# Altium project led-wt32-eth01.PrjPcb
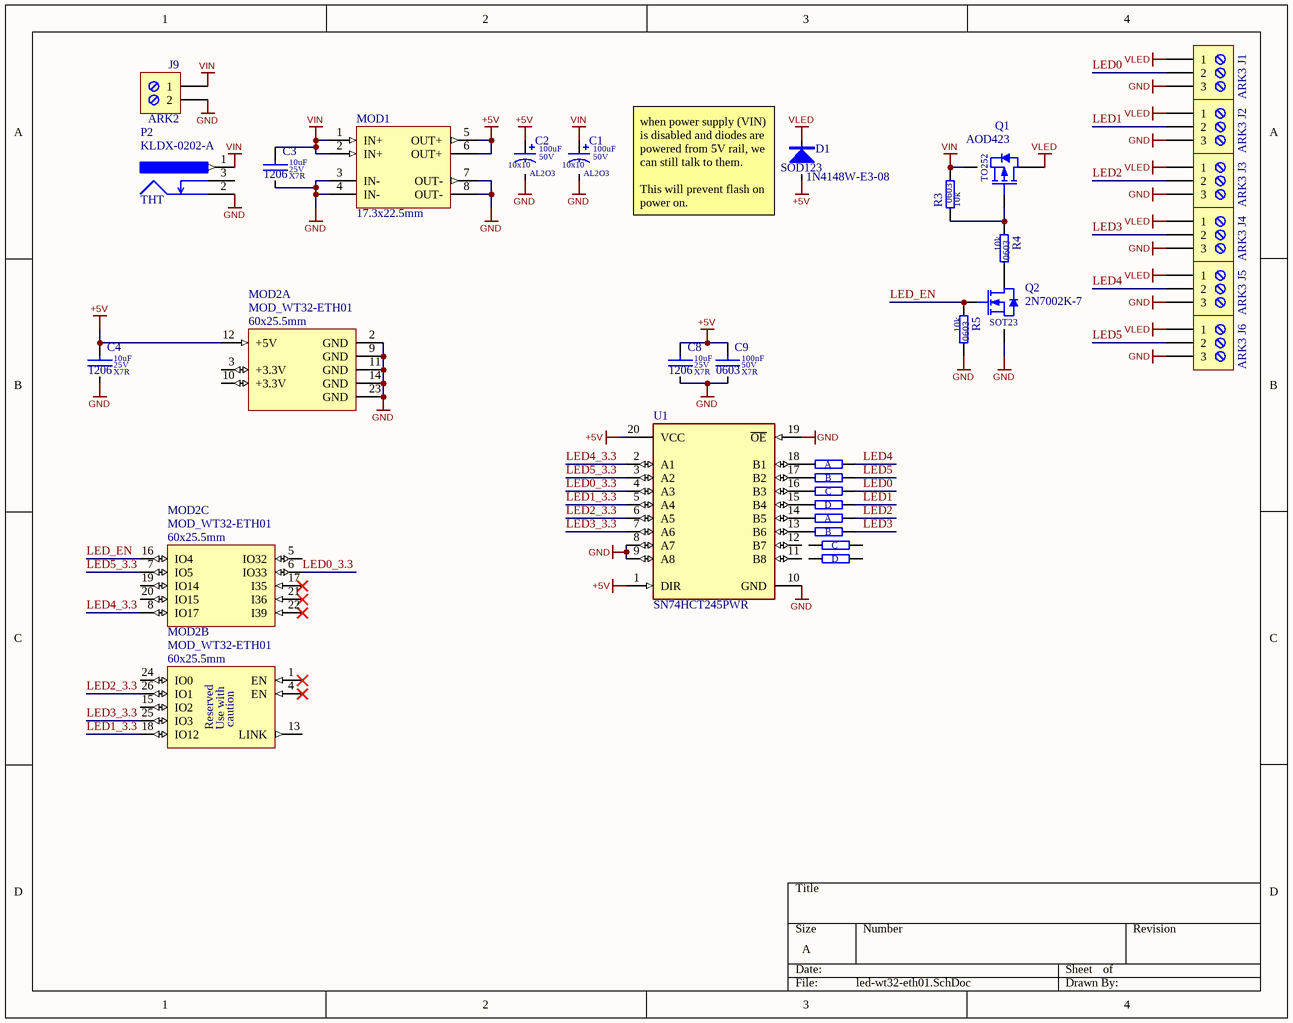
[diagram p0: led-wt32-eth01.SchDoc]
1 sheet, 25 parts. Net scope: global (net labels, ports and power ports of the same name join across sheets).
Board file: led-wt32-eth01.PcbDoc

## Sheet led-wt32-eth01.SchDoc
size A; SheetNumber: 1; SheetTotal: 1

### Parts
C1  value 100uF  Dielectric: AL2O3  SCH_Footprint: 10x10  Voltage: 50V  [CE_D_10x10_SMD]  (hidden comment: Electrolytic Capacitor)
C2  value 100uF  Dielectric: AL2O3  SCH_Footprint: 10x10  Voltage: 50V  [CE_D_10x10_SMD]  (hidden comment: Electrolytic Capacitor)
C3  value 10uF  Dielectric: X7R  Voltage: 25V  SCH_Footprint: 1206  [C_1206_3216]  (hidden comment: Ceramic X7R)
C4  value 10uF  Dielectric: X7R  Voltage: 25V  SCH_Footprint: 1206  [C_1206_3216]  (hidden comment: Ceramic X7R)
C8  value 10uF  Dielectric: X7R  Voltage: 25V  SCH_Footprint: 1206  [C_1206_3216]  (hidden comment: Ceramic X7R)
C9  value 100nF  Dielectric: X7R  Voltage: 50V  SCH_Footprint: 0603  [C_0603_1608]  (hidden comment: Ceramic X7R)
D1  value 1N4148W-E3-08  [SOD123]  (hidden comment: 1N4148W)
J1  ARK3  [J_ARK3]
J2  ARK3  [J_ARK3]
J3  ARK3  [J_ARK3]
J4  ARK3  [J_ARK3]
J5  ARK3  [J_ARK3]
J6  ARK3  [J_ARK3]
J9  ARK2  [J_ARK2]
MOD1  SCH_Footprint: 17.3x22.5mm  [MOD_BUCK_MP1584]  (hidden comment: Low cost, Aliexpress-ready DC-DC buck converter using MP1584)
MOD2  value MOD_WT32-ETH01  SCH_Footprint: 60x25.5mm  [MOD_WT32-ETH01]  (hidden comment: ESP32 with 10/100 Mbps Ethernet PHY)  (parts A,B,C of 3)
P2  value KLDX-0202-A  SCH_Footprint: THT  [P_KLDX-0202-A]  (hidden comment: DC JACK)
Q1  SCH_Footprint: TO252  [DPAK_TO252-3_SC63_M]  (hidden comment: AOD423)
Q2  SCH_Footprint: SOT23  [SOT23_TO236_SC59]  (hidden comment: 2N7002K-7)
R3  value 10k  SCH_Footprint: 0603  [R_0603_1608]  (hidden comment: Resistor)
R4  value 10k  SCH_Footprint: 0603  [R_0603_1608]  (hidden comment: Resistor)
R5  value 10k  SCH_Footprint: 0603  [R_0603_1608]  (hidden comment: Resistor)
RN1  Resistors Network  [RN4_0804_2010]  (value not drawn)  (parts A,B,C,D of 4)
RN2  Resistors Network  [RN4_0804_2010]  (value not drawn)  (parts A,B,C,D of 4)
U1  SN74HCT245PWR  [FP-PW0020A-MFG]

### Nets
+5V: C2.1 C4.1 C8.1 C9.1 D1.2 MOD1.5(OUT+) MOD1.6(OUT+) MOD2.12(+5V) U1.1(DIR) U1.20(VCC)
GND: C1.2 C2.2 C3.2 C4.2 C8.2 C9.2 J1.3 J2.3 J3.3 J4.3 J5.3 J6.3 J9.2 MOD1.3(IN-) MOD1.4(IN-) MOD1.7(OUT-) MOD1.8(OUT-) MOD2.2(GND) MOD2.9(GND) MOD2.11(GND) MOD2.14(GND) MOD2.23(GND) P2.2 Q2.2(S) R5.2 U1.8(A7) U1.9(A8) U1.10(GND) U1.19(~{OE})
VIN: C1.1 C3.1 J9.1 MOD1.1(IN+) MOD1.2(IN+) P2.1 Q1.3(S) R3.2
VLED: D1.1 J1.1 J2.1 J3.1 J4.1 J5.1 J6.1 Q1.2(D)
LED0: J1.2 RN1.6
LED0_3.3: MOD2.6(IO33) U1.4(A3)
LED1: J2.2 RN1.5
LED1_3.3: MOD2.18(IO12) U1.5(A4)
LED2: J3.2 RN2.8
LED2_3.3: MOD2.26(IO1) U1.6(A5)
LED3: J4.2 RN2.7
LED3_3.3: MOD2.25(IO3) U1.7(A6)
LED4: J5.2 RN1.8
LED4_3.3: MOD2.8(IO17) U1.2(A1)
LED5: J6.2 RN1.7
LED5_3.3: MOD2.7(IO5) U1.3(A2)
LED_EN: MOD2.16(IO4) Q2.1(G) R5.1
NetQ1_1: Q1.1(G) R3.1 R4.1
NetQ2_3: Q2.3(D) R4.2
NetRN1_1: RN1.1 U1.18(B1)
NetRN1_2: RN1.2 U1.17(B2)
NetRN1_3: RN1.3 U1.16(B3)
NetRN1_4: RN1.4 U1.15(B4)
NetRN2_1: RN2.1 U1.14(B5)
NetRN2_2: RN2.2 U1.13(B6)

Not connected (* = marked no-connect by the designer): MOD2 1(EN)* 3(+3.3V) 4(EN)* 5(IO32) 10(+3.3V) 13(LINK) 15(IO2) 17(I35)* 19(IO14) 20(IO15) 21(I36)* 22(I39)* 24(IO0); P2 3; RN2 3 4 5 6; U1 11(B8) 12(B7)

### Notes on the sheet
- (near D1) when power supply (VIN) is disabled and diodes are powered from 5V rail, we can still talk to them.
  This will prevent flash on power on.
- (in symbol MOD_WT32-ETH01, part B) Reserved; Use with; caution
- (in symbol RN4_120R_0804_5, part A) A
- (in symbol RN4_120R_0804_5, part B) B
- (in symbol RN4_120R_0804_5, part C) C
- (in symbol RN4_120R_0804_5, part D) D

### Library data of the parts
C1 C2 = CE_100uF_50V_AL2O3_10x10_20: Polarized Capacitor; Manufacturer: Nichicon; Manufacturer Part Number: UUX1H101MNL1GS; Tolerance (%): 20; Part Number: CE_100uF_50V_AL2O3_10x10_20; HelpURL: https://datasheet.octopart.com/UUX1H101MNL1GS-Nichicon-datasheet-62047998.pdf; Supplier 1: TME; Supplier Part Number 1: UUX1H101MNL1GS; Supplier 2: RS Components; Supplier Part Number 2: 7393107; Supplier 3: Farnell; Supplier Part Number 3: 2841943; Supplier 4: Mouser; Supplier Part Number 4: 647-UUX1H101MNL1GS; Supplier 5: Digi-Key; Supplier Part Number 5: 493-6269-1-ND; Supplier 6: LCSC
C3 C4 C8 = C_10uF_25V_X7R_1206_10: Capacitor; Manufacturer: Samsung; Manufacturer Part Number: CL31B106KAHNNNE; Tolerance (%): 10; Part Number: C_10uF_25V_X7R_1206_10; HelpURL: http://www.tme.eu/pl/Document/4a42202b32dab16128fe107dd69598cc/samsung-chip-cap.pdf; Supplier 1: TME; Supplier Part Number 1: CL31B106KAHNNNE; Supplier 2: RS Components; Supplier Part Number 2: 766-6773; Supplier 3: Farnell; Supplier Part Number 3: 3013526; Supplier 4: Mouser; Supplier Part Number 4: 187-CL31B106KAHNNNE; Supplier 5: Digi-Key; Supplier Part Number 5: 1276-1804-1-ND; Supplier 6: LCSC
C9 = C_100nF_50V_X7R_0603_5: Capacitor; Manufacturer: Samsung; Manufacturer Part Number: CL10B104JB8NNNC; Tolerance (%): 5; Part Number: C_100nF_50V_X7R_0603_5; HelpURL: http://www.tme.eu/pl/Document/4a42202b32dab16128fe107dd69598cc/samsung-chip-cap.pdf; Supplier 1: TME; Supplier Part Number 1: CL10B104JB8NNNC; Supplier 2: RS Components; Supplier Part Number 2: 7665455; Supplier 3: Farnell; Supplier 4: Mouser; Supplier 5: Digi-Key; Supplier Part Number 5: 1276-1033-1-ND; Supplier 6: LCSC; Supplier Part Number 6: C24452
D1 = D_1N4148W_0A15_75V_SOD123: Manufacturer: Vishay; Voltage: 75; Current: 0.15A; SCH_Footprint: SOD123; Part Number: D_1N4148W_0A15_75V_SOD123; HelpURL: https://datasheet.octopart.com/1N4148W-E3-08-Vishay-datasheet-17291302.pdf; Manufacturer Part Number: 1N4148W-E3-08; Supplier 1: TME; Supplier Part Number 1: 1N4148W-E3-08; Supplier 2: RS Components; Supplier Part Number 2: 7003671; Supplier 3: Farnell; Supplier Part Number 3: 2433353; Supplier 4: Mouser; Supplier Part Number 4: 78-1N4148W-E3-08; Supplier 5: Digi-Key; Supplier Part Number 5: 1N4148W-E3-08CT-ND; Supplier 6: LCSC
J1-J6 = J_TB-5.0-P-3P: ARK Screw terminal, 3-Pin; Manufacturer: DEGSON ELECTRONICS; Value: DG301-5.0-03P-12-18A(H); SCH_Footprint: ARK3; Part Number: J_TB-5.0-P-3P; HelpURL: https://datasheet.octopart.com/DG301-5.0-03P-12-18A%28H%29-Degson-datasheet-17801202.pdf; Manufacturer Part Number: DG301-5.0-03P-12-18A(H); Supplier 1: TME; Supplier Part Number 1: DG301-5.0-3/6B; Supplier 2: RS Components; Supplier 3: Farnell; Supplier 4: Mouser; Supplier 5: Digi-Key; Supplier 6: LCSC
J9 = J_TB-5.0-P-2P: ARK Screw terminal, 2-Pin; Manufacturer: DEGSON ELECTRONICS; Value: DG301-5.0-02P-12-18A(H); SCH_Footprint: ARK2; Part Number: J_TB-5.0-P-2P; HelpURL: https://datasheet.octopart.com/DG301-5.0-03P-12-18A%28H%29-Degson-datasheet-17801202.pdf; Manufacturer Part Number: DG301-5.0-02P-12-18A(H); Supplier 1: TME; Supplier Part Number 1: DG301-5.0-2/6B; Supplier 2: RS Components; Supplier 3: Farnell; Supplier 4: Mouser; Supplier 5: Digi-Key; Supplier 6: LCSC
MOD1 = MOD_BUCK_MP1584: Value: -; Part Number: MOD_BUCK_MP1584; HelpURL: https://pl.aliexpress.com/item/32341006065.html; Manufacturer: -; Manufacturer Part Number: -; Supplier 1: TME; Supplier 2: RS Components; Supplier 3: Farnell; Supplier 4: Mouser; Supplier 5: Digi-Key; Supplier 6: LCSC; Supplier 7: -; Supplier Part Number 7: -
MOD2 = MOD_WT32-ETH01: Manufacturer: WT; Part Number: MOD_WT32-ETH01; HelpURL: https://github.com/egnor/wt32-eth01; Manufacturer Part Number: MOD_WT32-ETH01; Supplier 1: TME; Supplier 2: RS Components; Supplier 3: Farnell; Supplier 4: Mouser; Supplier 5: Digi-Key; Supplier 6: LCSC; Supplier 7: Aliexpress; Supplier Part Number 7: -
P2 = P_KLDX-0202-A: Typical 3-pin jack power connector with switch; Manufacturer: Kycon; Part Number: P_KLDX-0202-A; HelpURL: http://www.kycon.com/2013Catalogpage/DC%20Power/KLDX_0202.pdf; Manufacturer Part Number: KLDX-0202-A; Supplier 1: TME; Supplier 2: RS Components; Supplier 3: Farnell; Supplier Part Number 3: 2839850; Supplier 4: Mouser; Supplier Part Number 4: 806-KLDX-0202-A; Supplier 5: Digi-Key; Supplier Part Number 5: 2092-KLDX-0202-A-ND; Supplier 6: LCSC
Q1 = QP_AOD423: Manufacturer: Alpha&Omega Semiconductor; Type: P-MOS; Voltage: 30V; Current: 67A; Value: AOD423; Part Number: QP_AOD423; HelpURL: https://www.aosmd.com/sites/default/files/res/datasheets/AOI423.pdf; Manufacturer Part Number: AOD423; Supplier 1: TME; Supplier Part Number 1: AOD423; Supplier 2: RS Components; Supplier 3: Farnell; Supplier 4: Mouser; Supplier 5: Digi-Key; Supplier 6: LCSC
Q2 = QN_2N7002K-7: Manufacturer: Diodes Inc; Type: N-MOS; Voltage: 60V; Current: 0A8; Value: 2N7002K-7; Part Number: QN_2N7002K-7; HelpURL: http://datasheet.octopart.com/2N7002K-7-Diodes-Inc.-datasheet-12515815.pdf; Manufacturer Part Number: 2N7002K-7; Supplier 1: TME; Supplier 2: RS Components; Supplier Part Number 2: 7703383; Supplier 3: Farnell; Supplier Part Number 3: 1713825; Supplier 4: Mouser; Supplier Part Number 4: 621-2N7002K-7; Supplier 5: Digi-Key; Supplier Part Number 5: 2N7002K-7DICT-ND; Supplier 6: LCSC
R3-R5 = R_10k_0603_1: Manufacturer: Vishay; Manufacturer Part Number: CRCW060310K0FKTA; Voltage: 75V; Power: 100mW; Tolerance: 1%; Part Number: R_10k_0603_1; HelpURL: https://octopart.com/datasheet/crcw060310k0fkta-vishay-39447548; Supplier 1: TME; Supplier Part Number 1: CRCW060310K0FKTABC; Supplier 2: RS Components; Supplier 3: Farnell; Supplier Part Number 3: 1652827; Supplier 4: Mouser; Supplier Part Number 4: 71-CRCW0603-10K; Supplier 5: Digi-Key; Supplier Part Number 5: 541-2980-1-ND; Supplier 6: LCSC
RN1 RN2 = RN4_120R_0804_5: Manufacturer: Panasonic; Manufacturer Part Number: EXB-28V121JX; SCH_Footprint: 0804; Value: 120R; Voltage: 50V; Power: 63mW; Tolerance: 5%; Part Number: RN4_120R_0804_5; HelpURL: http://industrial.panasonic.com/cdbs/www-data/pdf/AOC0000/AOC0000C14.pdf; Supplier 1: TME; Supplier 2: RS Components; Supplier 3: Farnell; Supplier Part Number 3: 2060045; Supplier 4: Mouser; Supplier Part Number 4: 667-EXB-28V121JX; Supplier 5: Digi-Key; Supplier Part Number 5: Y7121CT-ND; Supplier 6: LCSC
U1 = CMP-1620-00542-3: IC TXRX NON-INVERT 5.5V 20TSSOP; Number of Circuits: 8; Propagation Delay: 74ns; Operating Supply Voltage: 5V; Logic Function: Transceiver; Quiescent Current: 8uA; Min Supply Voltage: 4.5V; Direction: Bidirectional; Number of Elements: 1; High Level Output Current: -6mA; Polarity: Non-Inverting; Low Level Output Current: 6mA; Number of Bits per Element: 8; Max Supply Voltage: 5.5V; Mount: Surface Mount; Package Quantity: 2000; Number of Pins: 20; Turn-On Delay Time: 74ns; Number of Bits: 8; Radiation Hardening: No; Contact Plating: Gold; Packaging: Tape and Reel; Case/Package: TSSOP; Lead Free: Lead Free; Min Operating Temperature: -40°C; Weight: 0.002716oz; Number of Channels: 8; Max Operating Temperature: 85°C; Number of Outputs: 8; REACH SVHC: No SVHC